# EAGLE design B137X (EAGLE 6.6.0)
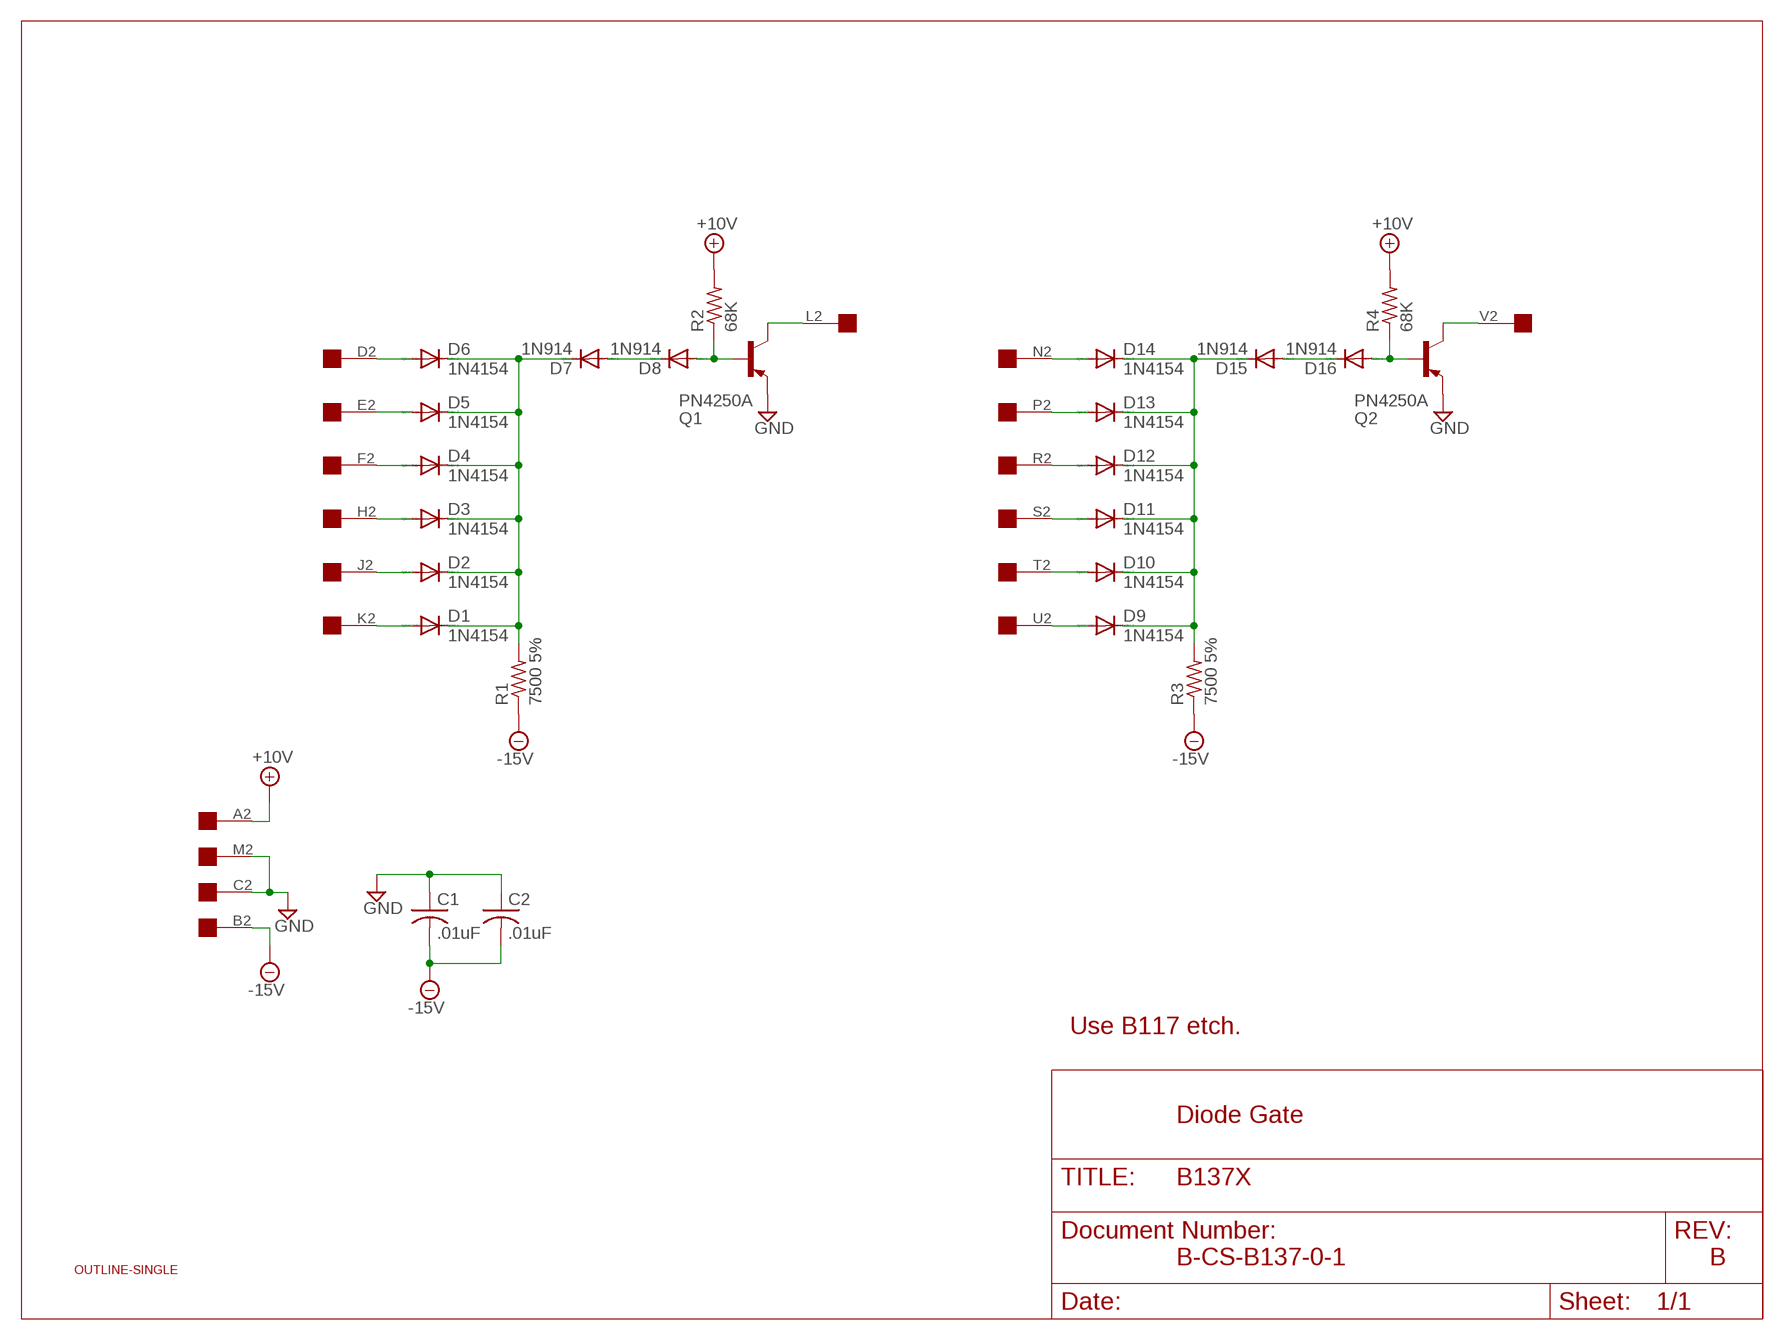
[diagram p0: schematic, sheet 1]

## Parts
C1  .01uF  C-US050-025X075  [C050-025X075]
C2  .01uF  C-US050-025X075  [C050-025X075]
D1  1N4154  DIODE-DO35-10  [DO35-10]
D2  1N4154  DIODE-DO35-10  [DO35-10]
D3  1N4154  DIODE-DO35-10  [DO35-10]
D4  1N4154  DIODE-DO35-10  [DO35-10]
D5  1N4154  DIODE-DO35-10  [DO35-10]
D6  1N4154  DIODE-DO35-10  [DO35-10]
D7  1N914  DIODE-DO35-10  [DO35-10]
D8  1N914  DIODE-DO35-10  [DO35-10]
D9  1N4154  DIODE-DO35-10  [DO35-10]
D10  1N4154  DIODE-DO35-10  [DO35-10]
D11  1N4154  DIODE-DO35-10  [DO35-10]
D12  1N4154  DIODE-DO35-10  [DO35-10]
D13  1N4154  DIODE-DO35-10  [DO35-10]
D14  1N4154  DIODE-DO35-10  [DO35-10]
D15  1N914  DIODE-DO35-10  [DO35-10]
D16  1N914  DIODE-DO35-10  [DO35-10]
Q1  PN4250A  -PNP-TO5  [TO5]
Q2  PN4250A  -PNP-TO5  [TO5]
R1  7500 5%  R-US_0207/10  [0207/10]
R2  68K  R-US_0207/10  [0207/10]
R3  7500 5%  R-US_0207/10  [0207/10]
R4  68K  R-US_0207/10  [0207/10]
U$1  OUTLINE-SINGLE  [SINGLE]
U$2  EDGE-1  [EDGE-CON1]

## Nets
+10V: R2.2 R4.2 U$2.A2
-15V: C1.2 C2.2 R1.1 R3.1 U$2.B2
D: D6.A U$2.D2
E: D5.A U$2.E2
F: D4.A U$2.F2
GND: C1.1 C2.1 Q1.1(E) Q2.1(E) U$2.C2 U$2.M2
H: D3.A U$2.H2
J: D2.A U$2.J2
K: D1.A U$2.K2
L: Q1.3(C) U$2.L2
N: D14.A U$2.N2
N$1: D1.C D2.C D3.C D4.C D5.C D6.C D7.C R1.2
N$2: D7.A D8.C
N$3: D8.A Q1.2(B) R2.1
N$4: D9.C D10.C D11.C D12.C D13.C D14.C D15.C R3.2
N$5: D15.A D16.C
N$6: D16.A Q2.2(B) R4.1
P: D13.A U$2.P2
R: D12.A U$2.R2
S: D11.A U$2.S2
T: D10.A U$2.T2
U: D9.A U$2.U2
V: Q2.3(C) U$2.V2

## Notes on the sheet
- Use B117 etch.
- Diode Gate
- B-CS-B137-0-1 | B

## Library data of the parts
C1 C2 = rcl:C-US: CAPACITOR, American symbol
D1-D16 = diode:DIODE-: DIODE
Q1 Q2 = transistor:*-PNP-: PNP Transistror
R1-R4 = rcl:R-US_: RESISTOR, American symbol
U$1 = dec-con:OUTLINE-*: Board outlines for DEC boards.
U$2 = dec-con:EDGE-1: Single-Sided DEC Edge Connector -- (side 2)

## Net classes
0 default: width 0.813 mm

## Board
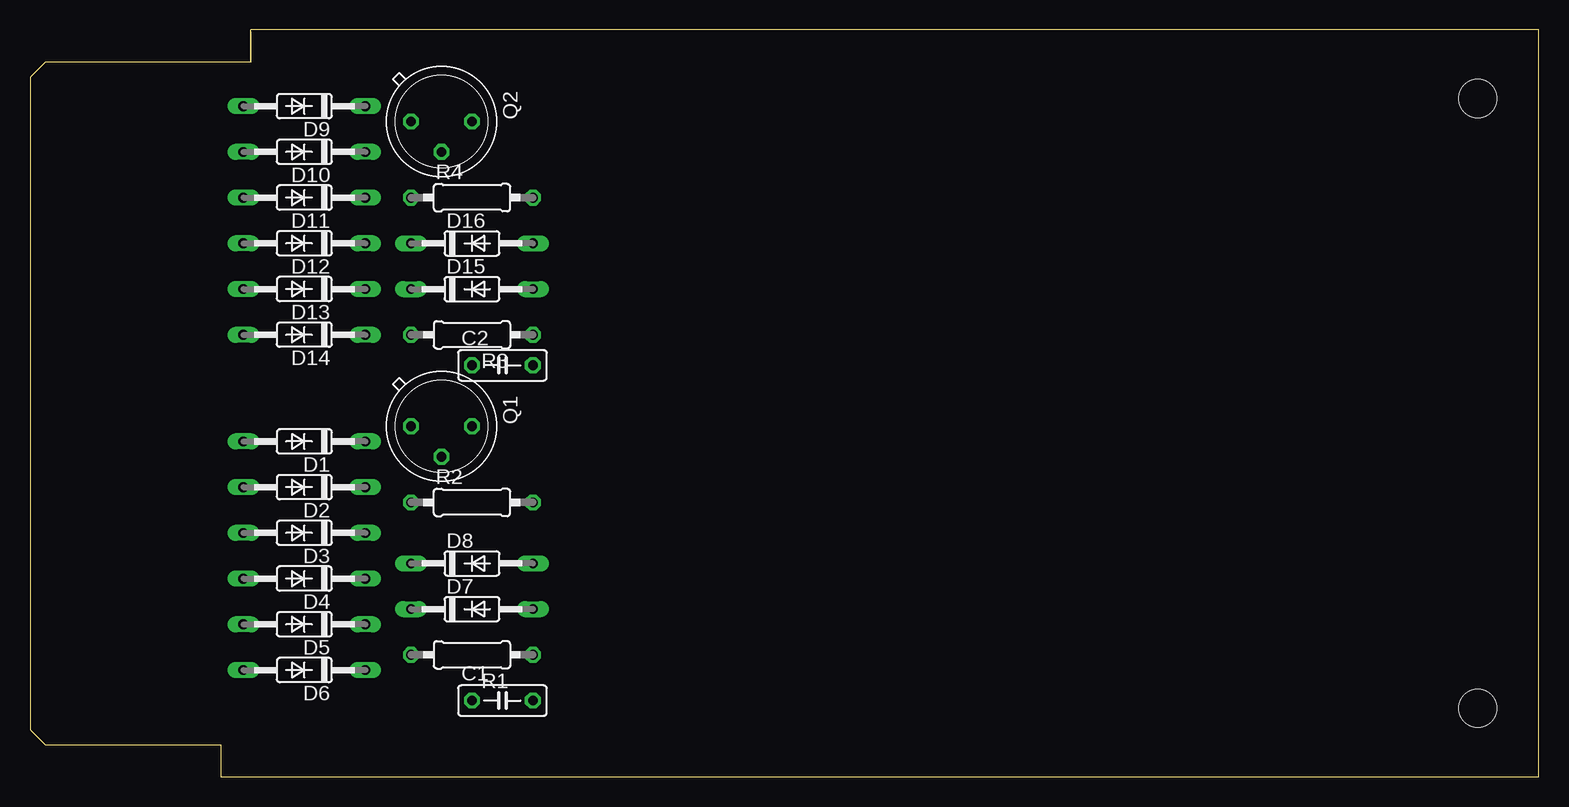
[diagram p1: board, top side]
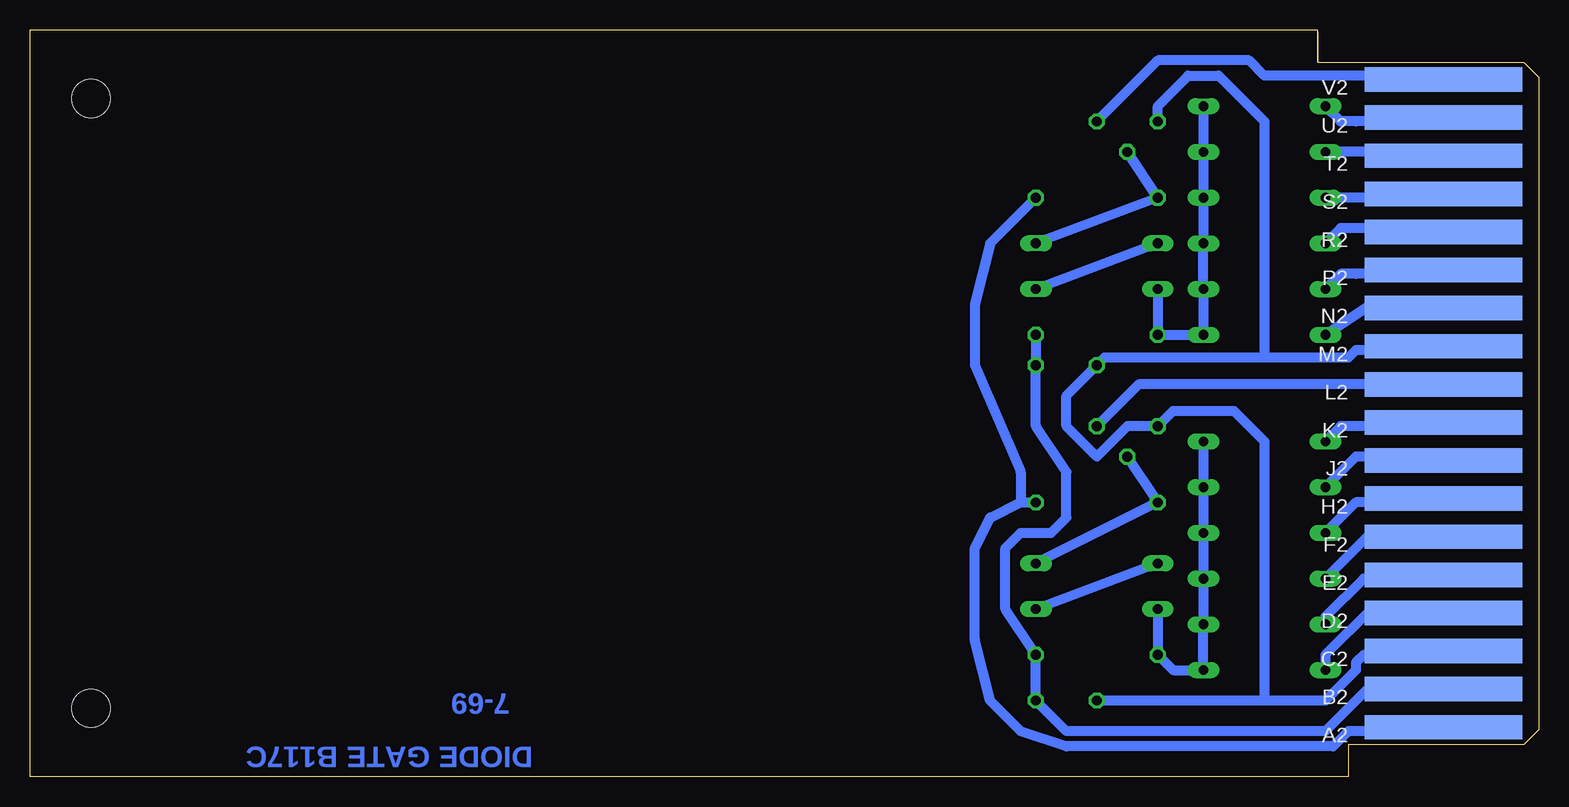
[diagram p2: board, bottom side, seen from below]

Size 125.73 x 62.23 mm. Coordinates in mm from the lower left corner, seen from the top.
Copper layers (1+16): Top 0.035mm / dielectric 1.5mm / Bottom 0.035mm
Design rules "16mils": minimum track width 16mil, minimum drill 32mil, track to track 15mil, track to pad 10mil, pad to pad 10mil, via to via 10mil, smd to smd 10mil, copper to edge 13mil, drill to drill 10mil, minimum pad ring 10mil, minimum via ring 8mil, stop-mask expansion 0mil, vias tented up to drill 0mil, thermal gap 10mil

### Footprints (pad centres in the part's own frame; a part is rotated, then mirrored left to right if it is on the bottom)
C050-025X075 = drill 0.813 octagon: 1 -2.54,0; 2 2.54,0
DO35-10 = drill 0.813 long: A 5.08,0; C -5.08,0
TO5 = drill 0.813 octagon: 1 0,-2.54; 2 2.54,0; 3 0,2.54
0207/10 = drill 0.813 octagon: 1 -5.08,0; 2 5.08,0
SINGLE = hole 3.175: 120.65,56.515; 120.65,5.715
EDGE-CON1 = smd 13.106 x 2.032 bottom: A2 7.938,4.128; B2 7.938,7.303; C2 7.938,10.477; D2 7.938,13.652; E2 7.938,16.828; F2 7.938,20.003; H2 7.938,23.177; J2 7.938,26.352; K2 7.938,29.527; L2 7.938,32.703; M2 7.938,35.877; N2 7.938,39.053; P2 7.938,42.227; R2 7.938,45.403; S2 7.938,48.578; T2 7.938,51.752; U2 7.938,54.928; V2 7.938,58.102

### Placement (x,y rotation side)
C1  39.37,6.35 0 top
C2  39.37,34.29 0 top
D1  22.86,27.94 180 top
D2  22.86,24.13 180 top
D3  22.86,20.32 180 top
D4  22.86,16.51 180 top
D5  22.86,12.7 180 top
D6  22.86,8.89 180 top
D7  36.83,13.97 0 top
D8  36.83,17.78 0 top
D9  22.86,55.88 180 top
D10  22.86,52.07 180 top
D11  22.86,48.26 180 top
D12  22.86,44.45 180 top
D13  22.86,40.64 180 top
D14  22.86,36.83 180 top
D15  36.83,40.64 0 top
D16  36.83,44.45 0 top
Q1  34.29,29.21 270 top
Q2  34.29,54.61 270 top
R1  36.83,10.16 180 top
R2  36.83,22.86 0 top
R3  36.83,36.83 180 top
R4  36.83,48.26 0 top
U$1  0,0 0 top
U$2  0,0 0 top

### Tracks (layer width: path | path; a pad name or v marks a point on that pad's centre or on a via)
+10V
  Bottom 0.813: U$2.A2 8.57,4.13 8.89,3.81 15.88,3.81 17.15,2.54 39.37,2.54 43.18,3.81 45.72,6.35 46.99,11.43 46.99,19.05 45.72,21.59 43.18,22.86 | R4.2 45.72,44.45 46.99,39.37 46.99,34.29 43.18,25.4 43.18,22.86 | 43.18,22.86 R2.2 43.18,22.86
-15V
  Bottom 0.813: U$2.B2 8.57,7.3 8.89,7.62 13.97,7.62 17.78,3.81 34.29,3.81 39.37,3.81 C1.2 R1.1 44.45,13.97 44.45,19.05 43.18,20.32 41.91,20.32 40.64,20.32 39.37,21.59 39.37,25.4 41.91,29.21 C2.2 R3.1
D
  Bottom 0.813: U$2.D2 8.57,13.65 8.89,13.97 13.97,13.97 17.78,10.16 D6.A
E
  Bottom 0.813: U$2.E2 8.57,16.83 8.89,16.51 14.61,16.51 17.78,13.34 D5.A
F
  Bottom 0.813: U$2.F2 9.84,20 10.16,20.32 13.97,20.32 D4.A
GND
  Bottom 0.813: U$2.C2 8.57,10.48 8.89,10.16 14.61,10.16 15.24,9.53 15.24,8.89 17.78,6.35 22.86,6.35 | 22.86,6.35 C1.1 | 22.86,6.35 22.86,27.94 25.4,30.48 30.48,30.48 Q1.1 34.29,29.21 36.83,26.67 39.37,29.21 39.37,31.75 C2.1 36.2,34.92 22.86,34.92 | U$2.M2 11.43,35.56 15.24,35.56 15.88,34.92 22.86,34.92 | Q2.1 31.75,55.88 29.21,58.42 26.67,58.42 22.86,54.61 22.86,34.92
H
  Bottom 0.813: U$2.H2 8.57,23.18 8.89,22.86 15.24,22.86 D3.A
J
  Bottom 0.813: U$2.J2 7.62,26.67 15.24,26.67 D2.A
K
  Bottom 0.813: U$2.K2 8.57,29.53 8.89,29.21 16.51,29.21 D1.A
L
  Bottom 0.813: U$2.L2 33.34,32.7 Q1.3
N
  Bottom 0.813: U$2.N2 8.89,39.37 13.97,39.37 D14.A
N$1
  Bottom 0.813: D7.C R1.2 30.48,8.89 D6.C D5.C D4.C D3.C D2.C D1.C
N$2
  Bottom 0.813: D8.C D7.A
N$3
  Bottom 0.813: D8.A R2.1 Q1.2
N$4
  Bottom 0.813: D9.C D10.C D11.C D12.C D13.C D14.C R3.2 D15.C
N$5
  Bottom 0.813: D16.C D15.A
N$6
  Bottom 0.813: D16.A R4.1 Q2.2
P
  Bottom 0.813: U$2.P2 8.89,41.91 15.24,41.91 16.51,41.91 D13.A
R
  Bottom 0.813: U$2.R2 7.62,45.72 16.51,45.72 D12.A
S
  Bottom 0.813: U$2.S2 9.84,48.58 10.16,48.26 D11.A
T
  Bottom 0.813: U$2.T2 8.57,51.75 8.89,52.07 D10.A
U
  Bottom 0.813: U$2.U2 8.57,54.93 8.89,54.61 15.24,54.61 16.51,54.61 D9.A
V
  Bottom 0.813: U$2.V2 8.57,58.1 8.89,58.42 22.86,58.42 24.13,59.69 31.75,59.69 Q2.3

### Text on the board
Bottom: 7-69 | DIODE GATE B117C